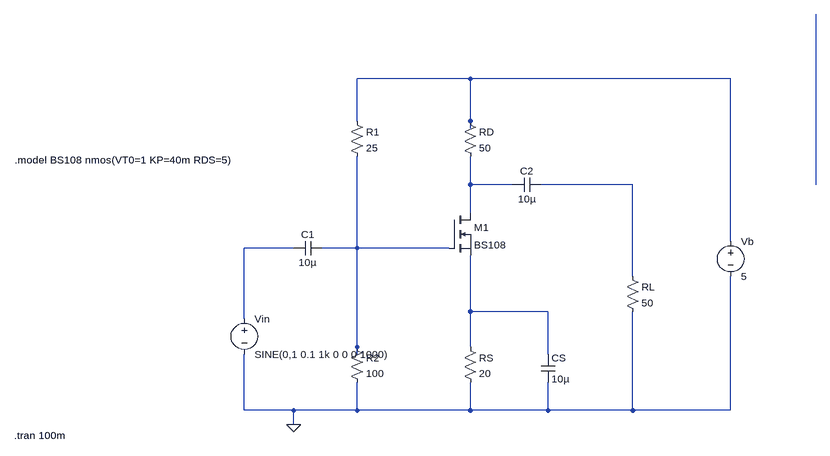
[diagram p0: schematic MOSFETAmplifierCircuit.asc]
MOSFETAmplifierCircuit.asc, the LTspice schematic file:
Version 4
SHEET 1 5236 680
WIRE 208 -176 -160 -176
WIRE 816 -176 208 -176
WIRE -160 -80 -160 -176
WIRE 208 -80 208 -176
WIRE 208 -64 208 -80
WIRE 208 64 208 0
WIRE 304 64 208 64
WIRE 576 64 368 64
WIRE 5232 64 5232 -12480
WIRE 208 128 208 64
WIRE 816 192 816 -176
WIRE -304 208 -416 208
WIRE -160 208 -160 0
WIRE -160 208 -240 208
WIRE 160 208 -160 208
WIRE 576 272 576 64
WIRE 208 352 208 224
WIRE 384 352 208 352
WIRE -416 368 -416 208
WIRE -160 432 -160 208
WIRE 208 432 208 352
WIRE -160 448 -160 432
WIRE 384 448 384 352
WIRE -416 576 -416 448
WIRE -304 576 -416 576
WIRE -160 576 -160 512
WIRE -160 576 -304 576
WIRE 208 576 208 512
WIRE 208 576 -160 576
WIRE 384 576 384 512
WIRE 384 576 208 576
WIRE 576 576 576 352
WIRE 576 576 384 576
WIRE 816 576 816 272
WIRE 816 576 576 576
WIRE -304 608 -304 576
FLAG -304 608 0
SYMBOL nmos 160 128 R0
SYMATTR InstName M1
SYMATTR Value BS108
SYMBOL res 192 -96 R0
SYMATTR InstName RD
SYMATTR Value 50
SYMBOL res 192 416 R0
SYMATTR InstName RS
SYMATTR Value 20
SYMBOL res -176 416 R0
SYMATTR InstName R2
SYMATTR Value 100
SYMBOL res -176 -96 R0
SYMATTR InstName R1
SYMATTR Value 25
SYMBOL cap -240 192 R90
WINDOW 0 0 32 VBottom 2
WINDOW 3 32 32 VTop 2
SYMATTR InstName C1
SYMATTR Value 10µ
SYMBOL cap 368 448 R0
SYMATTR InstName CS
SYMATTR Value 10µ
SYMBOL cap 368 48 R90
WINDOW 0 0 32 VBottom 2
WINDOW 3 32 32 VTop 2
SYMATTR InstName C2
SYMATTR Value 10µ
SYMBOL voltage -416 352 R0
WINDOW 123 0 0 Left 0
WINDOW 39 0 0 Left 0
SYMATTR InstName Vin
SYMATTR Value SINE(0,1 0.1 1k 0 0 0 1000)
SYMBOL voltage 816 176 R0
SYMATTR InstName Vb
SYMATTR Value 5
SYMBOL res 560 256 R0
SYMATTR InstName RL
SYMATTR Value 50
TEXT -936 8 Left 2 !.model BS108 nmos(VT0=1 KP=40m RDS=5)
TEXT -938 632 Left 2 !.tran 100m

The netlist it stands for:
* MOSFETAmplifierCircuit.asc
M1 N002 N006 N007 N007 BS108
RD N001 N002 50
RS N007 0 20
R2 N006 0 100
R1 N001 N006 25
C1 N006 N005 10µ
CS N007 0 10µ
C2 N003 N002 10µ
Vin N005 0 SINE(0,1 0.1 1k 0 0 0 1000)
Vb N001 0 5
RL N003 0 50
.model NMOS NMOS
.model PMOS PMOS
.lib standard.mos
.model BS108 nmos(VT0=1 KP=40m RDS=5)
.tran 100m
.backanno
.end